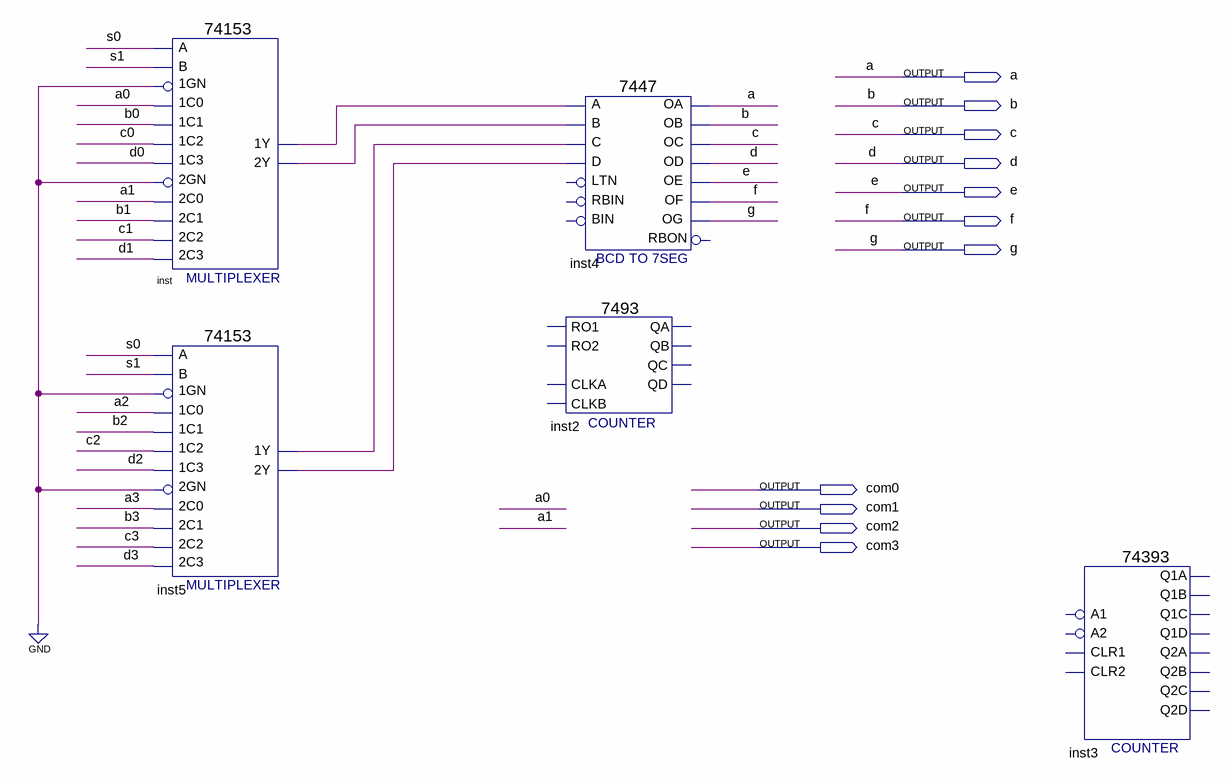
[diagram p0: schematic sheet]
// Quartus schematic Block1.bdf as structural Verilog: 5 symbols, 11 pins
module Block1 (
  output a,
  output b,
  output c,
  output d,
  output e,
  output f,
  output g,
  output com0,
  output com1,
  output com2,
  output com3
);

  wire a0, a1, a2, a3, b0, b1, b2, b3, c0, c1, c2, c3, d0, d1, d2, d3, inst5_1y, inst5_2y, inst_1y, inst_2y,
       s0, s1;

  \74153  inst (
    .\1C1 (b0), .\1GN (1'b0), .\1C0 (a0), .\2C0 (a1), .\2GN (1'b0), .\2C2 (c1), .\1C2 (c0), .\1C3 (d0),
    .B(s1), .A(s0), .\2C1 (b1), .\2C3 (d1), .\1Y (inst_1y), .\2Y (inst_2y));
  \74153  inst5 (
    .\1C1 (b2), .\1GN (1'b0), .\1C0 (a2), .\2C0 (a3), .\2GN (1'b0), .\2C2 (c3), .\1C2 (c2), .\1C3 (d2),
    .B(s1), .A(s0), .\2C1 (b3), .\2C3 (d3), .\1Y (inst5_1y), .\2Y (inst5_2y));
  \7447  inst4 (
    .B(inst_2y), .C(inst5_1y), .D(inst5_2y), .A(inst_1y), .OB(b), .OC(c), .OE(e), .OD(d), .OF(f), .OG(g),
    .OA(a));  // open: LTN, RBIN, BIN, RBON
  \7493  inst2 ();  // open: RO1, RO2, CLKA, CLKB, QC, QB, QA, QD
  \74393  inst3 ();  // open: A1, CLR1, A2, CLR2, Q2D, Q2C, Q2B, Q1C, Q1D, Q2A, Q1A, Q1B
endmodule
